# Altium project coilcube_frontend_v2.PrjPcb
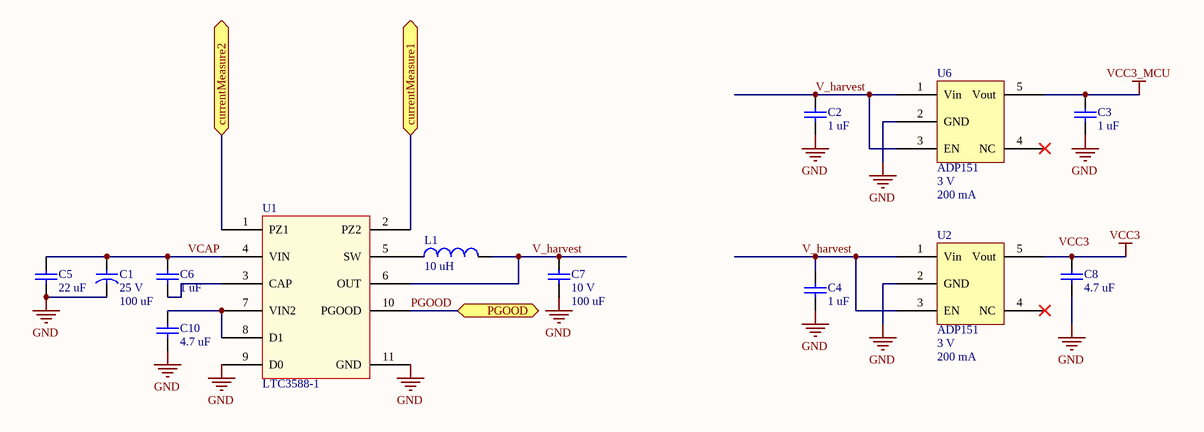
[diagram p0: harvesting2.SchDoc]
1 sheet, 13 parts. Net scope: flat (ports and power ports of the same name join across sheets).
Board files: Genimi_v7.PcbDoc, G2_v7_array.PcbDoc

## Sheet harvesting2.SchDoc: Gemini++
size Letter; Author: Ye-Sheng Kuo; Revision: 7; SheetTotal: 4

### Parts
C1  value 100 uF  voltage rated: 25 V  [2917]  (hidden comment: Ceramic capacitor)
C2  value 1 uF  [0402]  (hidden comment: Ceramic capacitor)
C3  value 1 uF  [0402]  (hidden comment: Ceramic capacitor)
C4  value 1 uF  [0402]  (hidden comment: Ceramic capacitor)
C5  value 22 uF  [1206]  (hidden comment: Ceramic capacitor)
C6  value 1 uF  [0402]  (hidden comment: Ceramic capacitor)
C7  value 100 uF  voltage rated: 10 V  [1210]  (hidden comment: Ceramic capacitor)
C8  value 4.7 uF  [0603]  (hidden comment: Ceramic capacitor)
C10  value 4.7 uF  [0603]  (hidden comment: Ceramic capacitor)
L1  value 10 uH  [CDRH2D18]  (hidden comment: Chip inductor)
U1  LTC3588-1  [TSSOP50P490X110_HS-11N]
U2  ADP151  Voltage: 3 V  Current: 200 mA  [SOT23-5]
U6  ADP151  Voltage: 3 V  Current: 200 mA  [SOT23-5]

### Ports
currentMeasure1, currentMeasure2, PGOOD

### Nets
GND: C1.2 C2.2 C3.2 C4.2 C5.2 C7.2 C8.2 C10.2 U1.9(D0) U1.11(GND) U2.2(GND) U6.2(GND)
VCC3: C8.1 U2.5(Vout)
VCC3_MCU: C3.1 U6.5(Vout)
PGOOD: U1.10(PGOOD) ; port PGOOD
V_harvest: C2.1 C4.1 C7.1 L1.1 U1.6(OUT) U2.1(Vin) U2.3(EN) U6.1(Vin) U6.3(EN)
VCAP: C1.1 C5.1 C6.1 U1.4(VIN)
NetC6_2: C6.2 U1.3(CAP)
NetC10_1: C10.1 U1.7(VIN2) U1.8(D1)
NetL1_2: L1.2 U1.5(SW)
NetU1_1: U1.1(PZ1) ; port currentMeasure2
NetU1_2: U1.2(PZ2) ; port currentMeasure1

Not connected (* = marked no-connect by the designer): U2 4(NC)*; U6 4(NC)*

### Notes on the sheet
- Labels drawn without touching a wire or pin: VCC3
- Title
- Date:
- Author:
- Revision:
- Sheet
- of
- University of Michigan
- File:

### Library data of the parts
C1 = C_100u_25V_2917_tantalum: Tantalum capacitor, 100u, 2917 package; Manufacture: Kemet; tolerance: 10%; package: 2917; Supplier 1: Digi-Key; Supplier Part Number 1: 399-8410-1-ND
C2-C4 C6 = C_1u_16V_0402_ceramic: Ceramic capacitor, 1 uF, 16V, 0402 package; Manufacture: TDK; tolerance: 10%; Temperature rating: X5R; voltage rated: 16 V; package: 0402; Supplier 1: Digi-Key; Supplier Part Number 1: 445-4978-1-ND
C5 = C_22u_35V_1206_ceramic: Ceramic capacitor, 22 uF, 35 V, 1206 package; Manufacture: TDK; voltage rated: 35 V; tolerance: 20%; package: 1206; Supplier 1: Digi-Key; Supplier Part Number 1: 445-8045-1-ND
C7 = C_100u_10V_1210_ceramic: Ceramic capacitor, 100u, 1210 package; Manufacture: Samsung; tolerance: 20%; package: 2917; Supplier 1: Digi-Key; Supplier Part Number 1: 1276-3364-1-ND
C8 C10 = C_4.7u_10V_0603_ceramic: Ceramic capacitor, 4.7u, 10V, 0603 package; Manufacture: TDK; tolerance: 20%; Temp rating: X5R; package: 0603; voltage rated: 10 V; Supplier 1: Digi-Key; Supplier Part Number 1: 445-7482-1-ND
L1 = L_10uH_1A_180m: Chip inductor, 10 uH,  1A, 180 mOhm; tolerance: 30%; Supplier 1: Digi-Key; Supplier Part Number 1: 308-1959-1-ND
U1 = LTC3588-1: Piezoelectric Energy   Harvesting Power Supply; Supplier 1: Digi-Key; Supplier Part Number 1: LTC3588EMSE-1#PBF-ND
U2 U6 = ADP151: Ultralow Noise, 200 mA,  CMOS Linear Regulator; Supplier 1: Digi-Key; Supplier Part Number 1: ADP151AUJZ-3.0-R7CT-ND